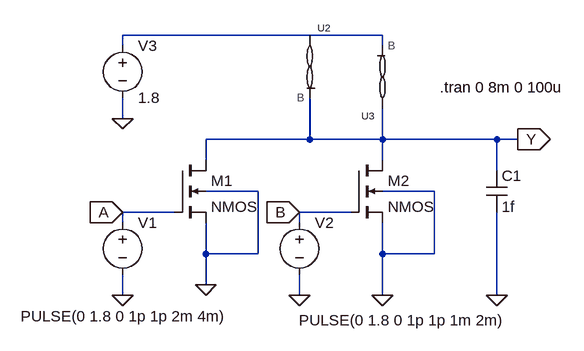
[diagram p0: schematic NOR2_using_Yakopcic.asc]
NOR2_using_Yakopcic.asc, the LTspice schematic file:
Version 4
SHEET 1 880 680
WIRE 240 16 -48 16
WIRE 352 16 240 16
WIRE -48 32 -48 16
WIRE 352 32 352 16
WIRE -48 144 -48 112
WIRE 240 176 240 112
WIRE 240 176 80 176
WIRE 352 176 352 128
WIRE 352 176 240 176
WIRE 528 176 352 176
WIRE 560 176 528 176
WIRE 80 208 80 176
WIRE 352 208 352 176
WIRE 528 224 528 176
WIRE 160 256 80 256
WIRE 432 256 352 256
WIRE 32 288 -48 288
WIRE 304 288 224 288
WIRE -48 304 -48 288
WIRE 224 304 224 288
WIRE 80 352 80 304
WIRE 160 352 160 256
WIRE 160 352 80 352
WIRE 352 352 352 304
WIRE 432 352 432 256
WIRE 432 352 352 352
WIRE 80 400 80 352
WIRE -48 416 -48 384
WIRE 224 416 224 384
WIRE 352 416 352 352
WIRE 528 416 528 288
FLAG 352 416 0
FLAG 80 400 0
FLAG 224 416 0
FLAG -48 416 0
FLAG -48 144 0
FLAG 560 176 Y
IOPIN 560 176 Out
FLAG -48 288 A
IOPIN -48 288 In
FLAG 224 288 B
IOPIN 224 288 In
FLAG 528 416 0
SYMBOL nmos4 32 208 R0
SYMATTR InstName M1
SYMATTR Value2 l=0.01u w=40u
SYMBOL nmos4 304 208 R0
SYMATTR InstName M2
SYMATTR Value2 l=0.01u w=40u
SYMBOL voltage -48 288 R0
WINDOW 3 271 166 Left 2
WINDOW 123 0 0 Left 0
WINDOW 39 0 0 Left 0
SYMATTR Value PULSE(0 1.8 0 1p 1p 1m 2m)
SYMATTR InstName V1
SYMBOL voltage 224 288 R0
WINDOW 3 -429 160 Left 2
WINDOW 123 0 0 Left 0
WINDOW 39 0 0 Left 0
SYMATTR Value PULSE(0 1.8 0 1p 1p 2m 4m)
SYMATTR InstName V2
SYMBOL voltage -48 16 R0
WINDOW 123 0 0 Left 0
WINDOW 39 0 0 Left 0
SYMATTR InstName V3
SYMATTR Value 1.8
SYMBOL cap 512 224 R0
SYMATTR InstName C1
SYMATTR Value 1f
SYMBOL memristor 240 64 R0
SYMATTR InstName U2
SYMBOL memristor 352 80 R180
SYMATTR InstName U3
TEXT 440 96 Left 2 !.tran 0 8m 0 100u

The netlist it stands for:
* NOR2_using_Yakopcic.asc
M1 Y A 0 0 NMOS l=0.01u w=40u
M2 Y B 0 0 NMOS l=0.01u w=40u
V1 A 0 PULSE(0 1.8 0 1p 1p 1m 2m)
V2 B 0 PULSE(0 1.8 0 1p 1p 2m 4m)
V3 N001 0 1.8
C1 Y 0 1f
XU2 Y memristor  ; pins B
XU3 N001 memristor  ; pins B
.model NMOS NMOS
.model PMOS PMOS
.lib standard.mos
.tran 0 8m 0 100u
.lib memristor.sub
.backanno
.end